# Altium schematic sheet 4_ADC.schdoc.schdoc
size 431 x 309 mm; Symbol: Sheet-Symbol_A4; Device: Sheet-Symbol_A4; Company: 嘉立创EDA; Version: V1.0; Page Size: A4; @Project Name: ProDocument_LN_CTRL_V1; @Page Count: 5; @Update Date: 2026-01-05; @Create Date: 2026-01-05; @Schematic Name: Schematic1; @Page No: 4; @Page Name: ADC
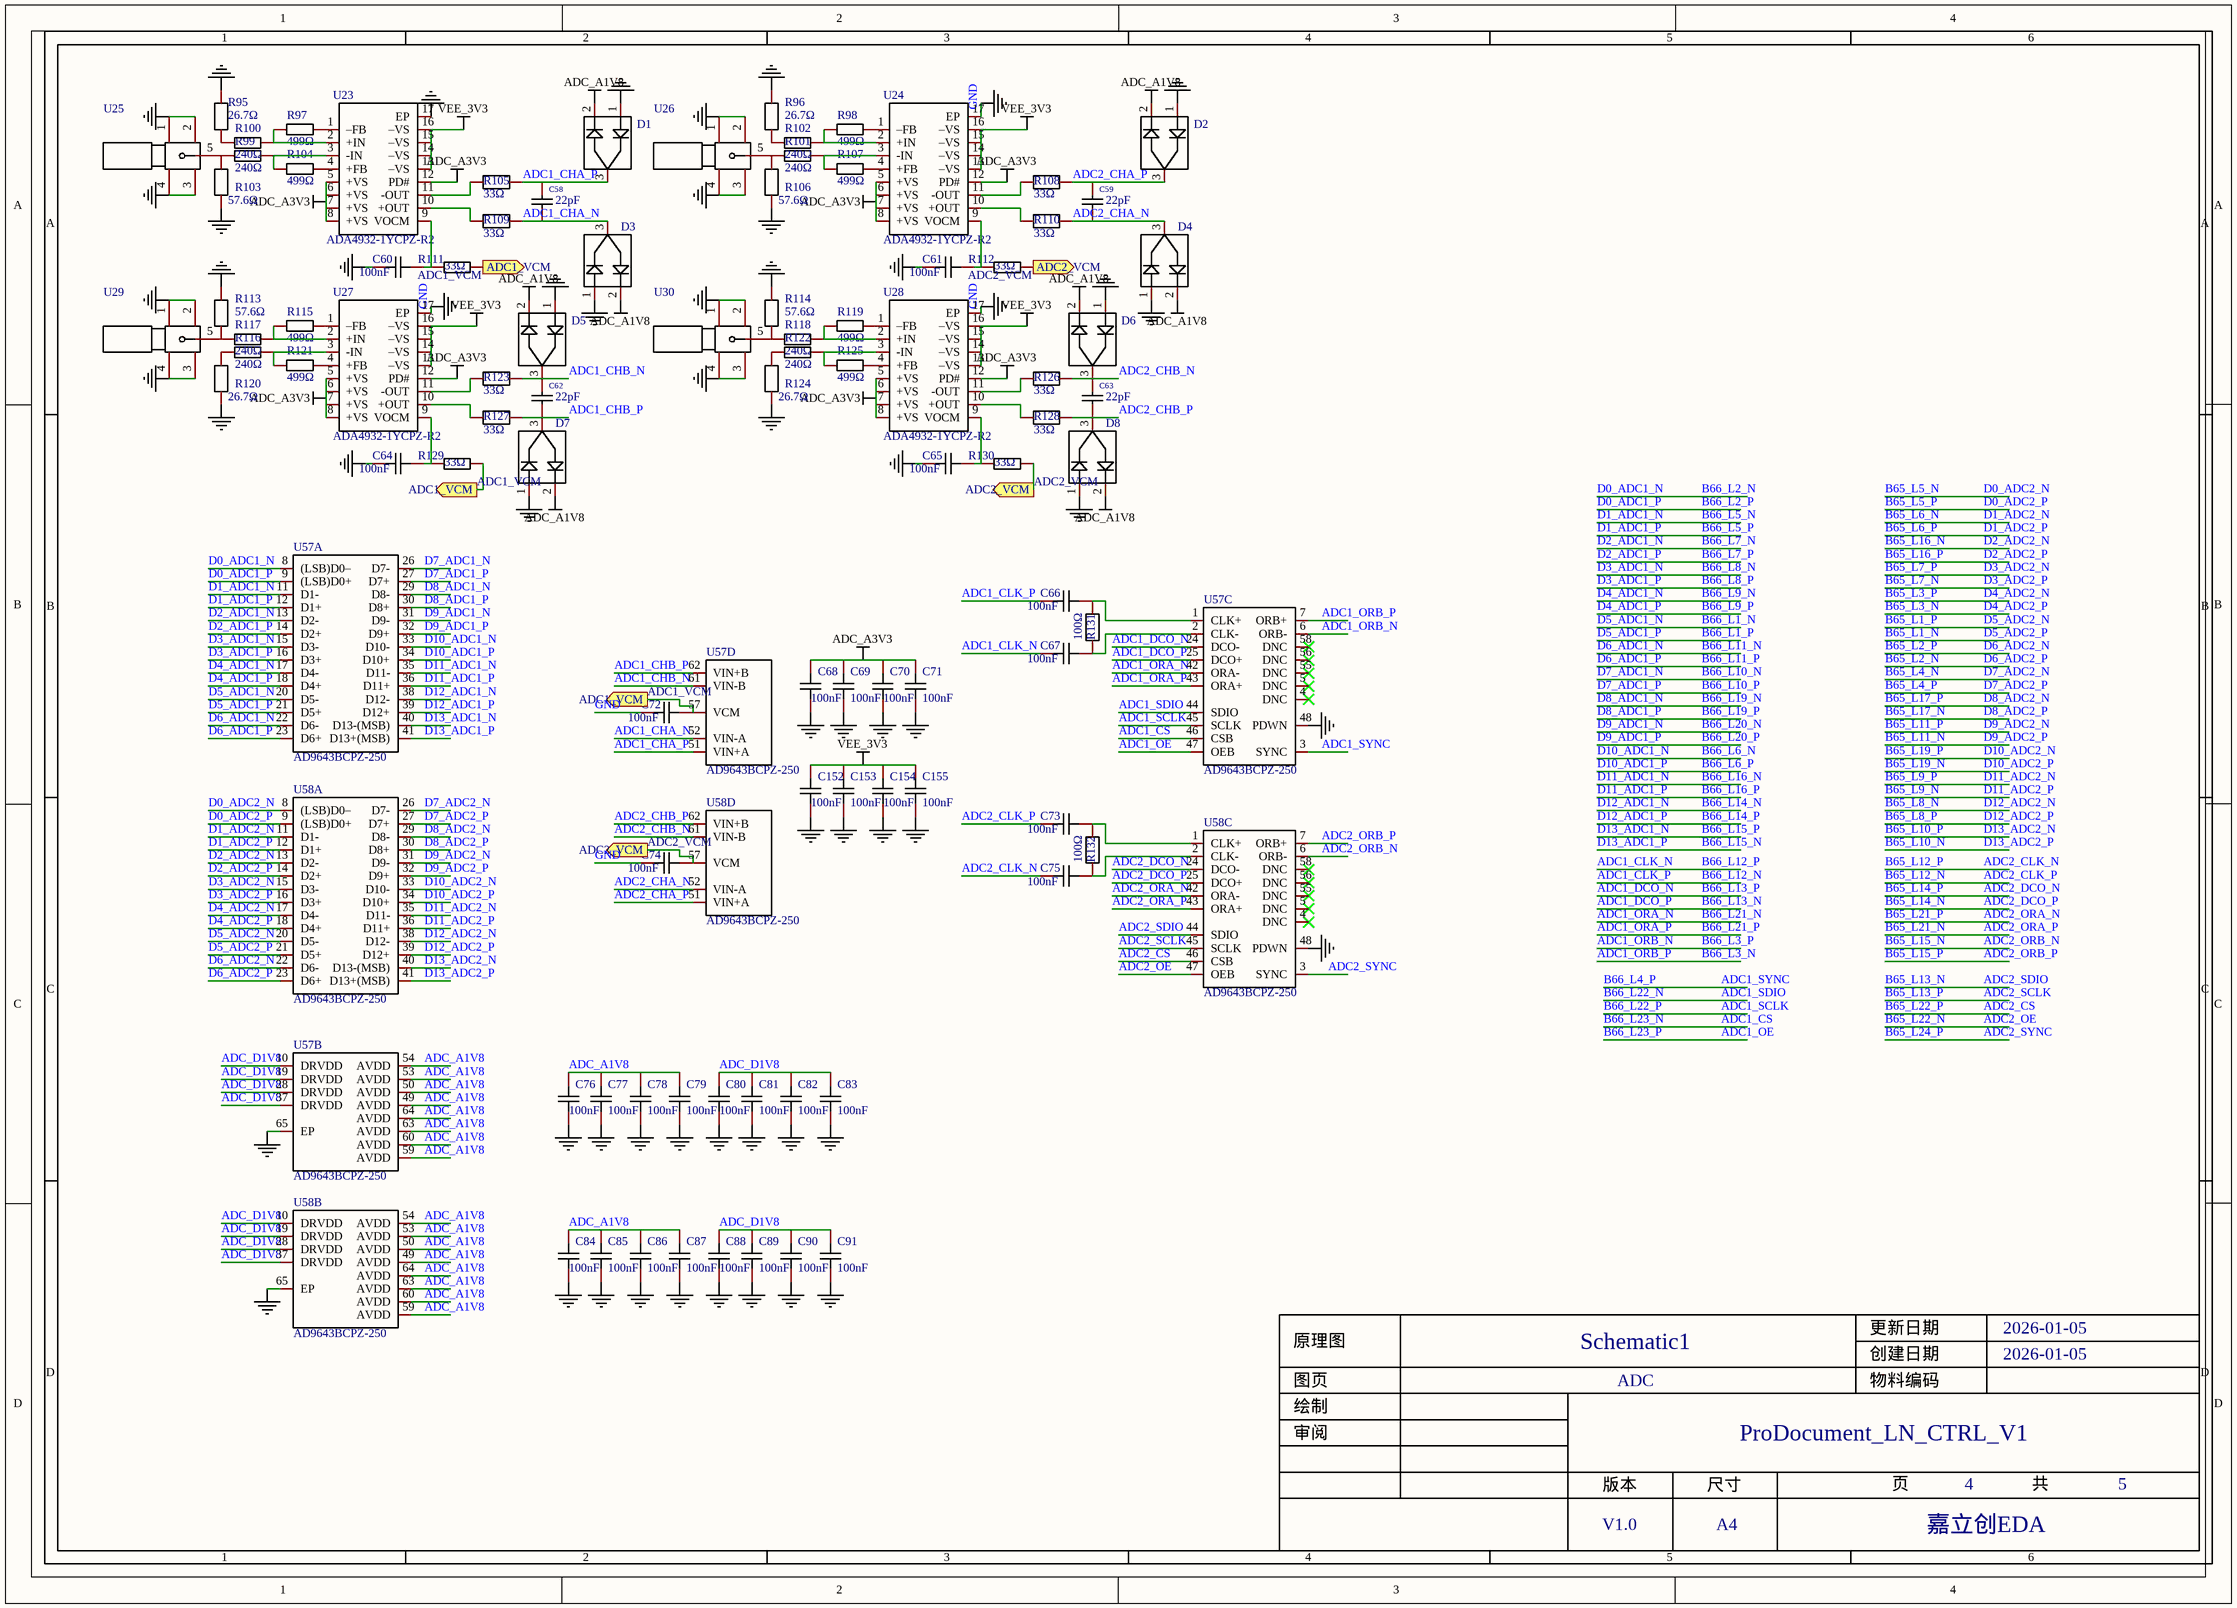
[diagram p0: 4_ADC.schdoc.schdoc]

## Parts
C58  22pF  [C0402]
C59  22pF  [C0402]
C60  100nF  [C0402]
C61  100nF  [C0402]
C62  22pF  [C0402]
C63  22pF  [C0402]
C64  100nF  [C0402]
C65  100nF  [C0402]
C66  100nF  [C0402]
C67  100nF  [C0402]
C68  100nF  [C0402]
C69  100nF  [C0402]
C70  100nF  [C0402]
C71  100nF  [C0402]
C72  100nF  [C0402]
C73  100nF  [C0402]
C74  100nF  [C0402]
C75  100nF  [C0402]
C76  100nF  [C0402]
C77  100nF  [C0402]
C78  100nF  [C0402]
C79  100nF  [C0402]
C80  100nF  [C0402]
C81  100nF  [C0402]
C82  100nF  [C0402]
C83  100nF  [C0402]
C84  100nF  [C0402]
C85  100nF  [C0402]
C86  100nF  [C0402]
C87  100nF  [C0402]
C88  100nF  [C0402]
C89  100nF  [C0402]
C90  100nF  [C0402]
C91  100nF  [C0402]
C152  100nF  [C0402]
C153  100nF  [C0402]
C154  100nF  [C0402]
C155  100nF  [C0402]
D1  NSVR351SDSA3T1G  [SC-59-3_L2.9-W1.5-P0.95-LS2.5-BR]  (value not drawn)
D2  NSVR351SDSA3T1G  [SC-59-3_L2.9-W1.5-P0.95-LS2.5-BR]  (value not drawn)
D3  NSVR351SDSA3T1G  [SC-59-3_L2.9-W1.5-P0.95-LS2.5-BR]  (value not drawn)
D4  NSVR351SDSA3T1G  [SC-59-3_L2.9-W1.5-P0.95-LS2.5-BR]  (value not drawn)
D5  NSVR351SDSA3T1G  [SC-59-3_L2.9-W1.5-P0.95-LS2.5-BR]  (value not drawn)
D6  NSVR351SDSA3T1G  [SC-59-3_L2.9-W1.5-P0.95-LS2.5-BR]  (value not drawn)
D7  NSVR351SDSA3T1G  [SC-59-3_L2.9-W1.5-P0.95-LS2.5-BR]  (value not drawn)
D8  NSVR351SDSA3T1G  [SC-59-3_L2.9-W1.5-P0.95-LS2.5-BR]  (value not drawn)
R95  value 26.7Ω  [R0402]  (hidden comment: ARG02BTC1001)
R96  value 26.7Ω  [R0402]  (hidden comment: ARG02BTC1001)
R97  499Ω  [R0402]
R98  499Ω  [R0402]
R99  240Ω  [R0402]
R100  240Ω  [R0402]
R101  240Ω  [R0402]
R102  240Ω  [R0402]
R103  value 57.6Ω  [R0402]  (hidden comment: ARG02BTC1001)
R104  499Ω  [R0402]
R105  value 33Ω  [R0402]  (hidden comment: ARG02BTC1001)
R106  value 57.6Ω  [R0402]  (hidden comment: ARG02BTC1001)
R107  499Ω  [R0402]
R108  value 33Ω  [R0402]  (hidden comment: ARG02BTC1001)
R109  value 33Ω  [R0402]  (hidden comment: ARG02BTC1001)
R110  value 33Ω  [R0402]  (hidden comment: ARG02BTC1001)
R111  33Ω  [R0402]
R112  33Ω  [R0402]
R113  value 57.6Ω  [R0402]  (hidden comment: ARG02BTC1001)
R114  value 57.6Ω  [R0402]  (hidden comment: ARG02BTC1001)
R115  499Ω  [R0402]
R116  240Ω  [R0402]
R117  240Ω  [R0402]
R118  240Ω  [R0402]
R119  499Ω  [R0402]
R120  value 26.7Ω  [R0402]  (hidden comment: ARG02BTC1001)
R121  499Ω  [R0402]
R122  240Ω  [R0402]
R123  value 33Ω  [R0402]  (hidden comment: ARG02BTC1001)
R124  value 26.7Ω  [R0402]  (hidden comment: ARG02BTC1001)
R125  499Ω  [R0402]
R126  value 33Ω  [R0402]  (hidden comment: ARG02BTC1001)
R127  value 33Ω  [R0402]  (hidden comment: ARG02BTC1001)
R128  value 33Ω  [R0402]  (hidden comment: ARG02BTC1001)
R129  33Ω  [R0402]
R130  33Ω  [R0402]
R131  100Ω  [R0402]
R132  100Ω  [R0402]
U23  ADA4932-1YCPZ-R2  [LFCSP-16_L3.0-W3.0-P0.50-BL-EP1.3]
U24  ADA4932-1YCPZ-R2  [LFCSP-16_L3.0-W3.0-P0.50-BL-EP1.3]
U25  MOLEX_SMA  [MOLEX_SMA]  (value not drawn)
U26  MOLEX_SMA  [MOLEX_SMA]  (value not drawn)
U27  ADA4932-1YCPZ-R2  [LFCSP-16_L3.0-W3.0-P0.50-BL-EP1.3]
U28  ADA4932-1YCPZ-R2  [LFCSP-16_L3.0-W3.0-P0.50-BL-EP1.3]
U29  MOLEX_SMA  [MOLEX_SMA]  (value not drawn)
U30  MOLEX_SMA  [MOLEX_SMA]  (value not drawn)
U57  AD9643BCPZ-250  [LFCSP-64_L9.0-W9.0-P0.50-BL-EP6.2]  (parts A,B,C,D of 4)
U58  AD9643BCPZ-250  [LFCSP-64_L9.0-W9.0-P0.50-BL-EP6.2]  (parts A,B,C,D of 4)

## Ports
ADC1_VCM (out), ADC2_VCM (out)

## Nets
ADC_A1V8: C76.2 C77.2 C78.2 C79.2 C84.2 C85.2 C86.2 C87.2 D1.2(Cathode) D2.2(Cathode) D3.2(Cathode) D4.2(Cathode) D5.2(Cathode) D6.2(Cathode) D7.2(Cathode) D8.2(Cathode) U57.49(AVDD) U57.50(AVDD) U57.53(AVDD) U57.54(AVDD) U57.59(AVDD) U57.60(AVDD) U57.63(AVDD) U57.64(AVDD) U58.49(AVDD) U58.50(AVDD) U58.53(AVDD) U58.54(AVDD) U58.59(AVDD) U58.60(AVDD) U58.63(AVDD) U58.64(AVDD)
ADC_A3V3: C68.2 C69.2 C70.2 C71.2 U23.5(+VS) U23.6(+VS) U23.7(+VS) U23.8(+VS) U23.12(PD#) U24.5(+VS) U24.6(+VS) U24.7(+VS) U24.8(+VS) U24.12(PD#) U27.5(+VS) U27.6(+VS) U27.7(+VS) U27.8(+VS) U27.12(PD#) U28.5(+VS) U28.6(+VS) U28.7(+VS) U28.8(+VS) U28.12(PD#)
GND: C60.2 C61.2 C64.2 C65.2 C68.1 C69.1 C70.1 C71.1 C72.2 C74.2 C76.1 C77.1 C78.1 C79.1 C80.1 C81.1 C82.1 C83.1 C84.1 C85.1 C86.1 C87.1 C88.1 C89.1 C90.1 C91.1 C152.1 C153.1 C154.1 C155.1 D1.1(Anode) D2.1(Anode) D3.1(Anode) D4.1(Anode) D5.1(Anode) D6.1(Anode) D7.1(Anode) D8.1(Anode) R95.1 R96.2 R103.2 R106.1 R113.2 R114.2 R120.1 R124.1 U23.17(EP) U24.17(EP) U25.1 U25.2 U25.3 U25.4 U26.1 U26.2 U26.3 U26.4 U27.17(EP) U28.17(EP) U29.1 U29.2 U29.3 U29.4 U30.1 U30.2 U30.3 U30.4 U57.48(PDWN) U57.65(EP) U58.48(PDWN) U58.65(EP)
VEE_3V3: C152.2 C153.2 C154.2 C155.2 U23.13(–VS) U23.14(–VS) U23.15(–VS) U23.16(–VS) U24.13(–VS) U24.14(–VS) U24.15(–VS) U24.16(–VS) U27.13(–VS) U27.14(–VS) U27.15(–VS) U27.16(–VS) U28.13(–VS) U28.14(–VS) U28.15(–VS) U28.16(–VS)
ADC1_CHA_N: C58.1 D3.3(Anode/Cathode) R109.1 U57.52(VIN-A)
ADC1_CHA_P: C58.2 D1.3(Anode/Cathode) R105.1 U57.51(VIN+A)
ADC1_CHB_N: C62.2 D5.3(Anode/Cathode) R123.1 U57.61(VIN-B)
ADC1_CHB_P: C62.1 D7.3(Anode/Cathode) R127.1 U57.62(VIN+B)
ADC1_CLK_N: C67.2  [also labelled B66_L12_P]
ADC1_CLK_P: C66.2  [also labelled B66_L12_N]
ADC1_CS: U57.46(CSB)  [also labelled B66_L23_N]
ADC1_DCO_N: U57.24(DCO-)  [also labelled B66_L13_P]
ADC1_DCO_P: U57.25(DCO+)  [also labelled B66_L13_N]
ADC1_OE: U57.47(OEB)  [also labelled B66_L23_P]
ADC1_ORA_N: U57.42(ORA-)  [also labelled B66_L21_N]
ADC1_ORA_P: U57.43(ORA+)  [also labelled B66_L21_P]
ADC1_ORB_N: U57.6(ORB-)  [also labelled B66_L3_P]
ADC1_ORB_P: U57.7(ORB+)  [also labelled B66_L3_N]
ADC1_SCLK: U57.45(SCLK)  [also labelled B66_L22_P]
ADC1_SDIO: U57.44(SDIO)  [also labelled B66_L22_N]
ADC1_SYNC: U57.3(SYNC)  [also labelled B66_L4_P]
ADC1_VCM: C72.1 R111.2 R129.2 U57.57(VCM) ; port ADC1_VCM
ADC2_CHA_N: C59.1 D4.3(Anode/Cathode) R110.1 U58.52(VIN-A)
ADC2_CHA_P: C59.2 D2.3(Anode/Cathode) R108.1 U58.51(VIN+A)
ADC2_CHB_N: C63.2 D6.3(Anode/Cathode) R126.1 U58.61(VIN-B)
ADC2_CHB_P: C63.1 D8.3(Anode/Cathode) R128.1 U58.62(VIN+B)
ADC2_CLK_N: C75.2  [also labelled B65_L12_P]
ADC2_CLK_P: C73.2  [also labelled B65_L12_N]
ADC2_CS: U58.46(CSB)  [also labelled B65_L22_P]
ADC2_DCO_N: U58.24(DCO-)  [also labelled B65_L14_P]
ADC2_DCO_P: U58.25(DCO+)  [also labelled B65_L14_N]
ADC2_OE: U58.47(OEB)  [also labelled B65_L22_N]
ADC2_ORA_N: U58.42(ORA-)  [also labelled B65_L21_P]
ADC2_ORA_P: U58.43(ORA+)  [also labelled B65_L21_N]
ADC2_ORB_N: U58.6(ORB-)  [also labelled B65_L15_N]
ADC2_ORB_P: U58.7(ORB+)  [also labelled B65_L15_P]
ADC2_SCLK: U58.45(SCLK)  [also labelled B65_L13_P]
ADC2_SDIO: U58.44(SDIO)  [also labelled B65_L13_N]
ADC2_SYNC: U58.3(SYNC)  [also labelled B65_L24_P]
ADC2_VCM: C74.1 R112.2 R130.2 U58.57(VCM) ; port ADC2_VCM
ADC_D1V8: C80.2 C81.2 C82.2 C83.2 C88.2 C89.2 C90.2 C91.2 U57.10(DRVDD) U57.19(DRVDD) U57.28(DRVDD) U57.37(DRVDD) U58.10(DRVDD) U58.19(DRVDD) U58.28(DRVDD) U58.37(DRVDD)
B65_L1_N: U58.21(D5+)  [also labelled D5_ADC2_P]
B65_L1_P: U58.20(D5-)  [also labelled D5_ADC2_N]
B65_L2_N: U58.23(D6+)  [also labelled D6_ADC2_P]
B65_L2_P: U58.22(D6-)  [also labelled D6_ADC2_N]
B65_L3_N: U58.18(D4+)  [also labelled D4_ADC2_P]
B65_L3_P: U58.17(D4-)  [also labelled D4_ADC2_N]
B65_L4_N: U58.26(D7-)  [also labelled D7_ADC2_N]
B65_L4_P: U58.27(D7+)  [also labelled D7_ADC2_P]
B65_L5_N: U58.8((LSB)D0–)  [also labelled D0_ADC2_N]
B65_L5_P: U58.9((LSB)D0+)  [also labelled D0_ADC2_P]
B65_L6_N: U58.11(D1-)  [also labelled D1_ADC2_N]
B65_L6_P: U58.12(D1+)  [also labelled D1_ADC2_P]
B65_L7_N: U58.16(D3+)  [also labelled D3_ADC2_P]
B65_L7_P: U58.15(D3-)  [also labelled D3_ADC2_N]
B65_L8_N: U58.38(D12-)  [also labelled D12_ADC2_N]
B65_L8_P: U58.39(D12+)  [also labelled D12_ADC2_P]
B65_L9_N: U58.36(D11+)  [also labelled D11_ADC2_P]
B65_L9_P: U58.35(D11-)  [also labelled D11_ADC2_N]
B65_L10_N: U58.41(D13+(MSB))  [also labelled D13_ADC2_P]
B65_L10_P: U58.40(D13-(MSB))  [also labelled D13_ADC2_N]
B65_L11_N: U58.32(D9+)  [also labelled D9_ADC2_P]
B65_L11_P: U58.31(D9-)  [also labelled D9_ADC2_N]
B65_L16_N: U58.13(D2-)  [also labelled D2_ADC2_N]
B65_L16_P: U58.14(D2+)  [also labelled D2_ADC2_P]
B65_L17_N: U58.30(D8+)  [also labelled D8_ADC2_P]
B65_L17_P: U58.29(D8-)  [also labelled D8_ADC2_N]
B65_L19_N: U58.34(D10+)  [also labelled D10_ADC2_P]
B65_L19_P: U58.33(D10-)  [also labelled D10_ADC2_N]
B66_L1_N: U57.20(D5-)  [also labelled D5_ADC1_N]
B66_L1_P: U57.21(D5+)  [also labelled D5_ADC1_P]
B66_L2_N: U57.8((LSB)D0–)  [also labelled D0_ADC1_N]
B66_L2_P: U57.9((LSB)D0+)  [also labelled D0_ADC1_P]
B66_L5_N: U57.11(D1-)  [also labelled D1_ADC1_N]
B66_L5_P: U57.12(D1+)  [also labelled D1_ADC1_P]
B66_L6_N: U57.33(D10-)  [also labelled D10_ADC1_N]
B66_L6_P: U57.34(D10+)  [also labelled D10_ADC1_P]
B66_L7_N: U57.13(D2-)  [also labelled D2_ADC1_N]
B66_L7_P: U57.14(D2+)  [also labelled D2_ADC1_P]
B66_L8_N: U57.15(D3-)  [also labelled D3_ADC1_N]
B66_L8_P: U57.16(D3+)  [also labelled D3_ADC1_P]
B66_L9_N: U57.17(D4-)  [also labelled D4_ADC1_N]
B66_L9_P: U57.18(D4+)  [also labelled D4_ADC1_P]
B66_L10_N: U57.26(D7-)  [also labelled D7_ADC1_N]
B66_L10_P: U57.27(D7+)  [also labelled D7_ADC1_P]
B66_L11_N: U57.22(D6-)  [also labelled D6_ADC1_N]
B66_L11_P: U57.23(D6+)  [also labelled D6_ADC1_P]
B66_L14_N: U57.38(D12-)  [also labelled D12_ADC1_N]
B66_L14_P: U57.39(D12+)  [also labelled D12_ADC1_P]
B66_L15_N: U57.41(D13+(MSB))  [also labelled D13_ADC1_P]
B66_L15_P: U57.40(D13-(MSB))  [also labelled D13_ADC1_N]
B66_L16_N: U57.35(D11-)  [also labelled D11_ADC1_N]
B66_L16_P: U57.36(D11+)  [also labelled D11_ADC1_P]
B66_L19_N: U57.29(D8-)  [also labelled D8_ADC1_N]
B66_L19_P: U57.30(D8+)  [also labelled D8_ADC1_P]
B66_L20_N: U57.31(D9-)  [also labelled D9_ADC1_N]
B66_L20_P: U57.32(D9+)  [also labelled D9_ADC1_P]
NetC60_1: C60.1 R111.1 U23.9(VOCM)
NetC61_1: C61.1 R112.1 U24.9(VOCM)
NetC64_1: C64.1 R129.1 U27.9(VOCM)
NetC65_1: C65.1 R130.1 U28.9(VOCM)
NetC66_1: C66.1 R131.2 U57.1(CLK+)
NetC67_1: C67.1 R131.1 U57.2(CLK-)
NetC73_1: C73.1 R132.2 U58.1(CLK+)
NetC75_1: C75.1 R132.1 U58.2(CLK-)
NetR95_2: R95.2 R100.1
NetR96_1: R96.1 R102.1
NetR97_1: R97.1 R100.2 U23.2(+IN)
NetR97_2: R97.2 U23.1(–FB)
NetR98_1: R98.1 R102.2 U24.2(+IN)
NetR98_2: R98.2 U24.1(–FB)
NetR99_1: R99.1 R103.1 U25.5
NetR99_2: R99.2 R104.1 U23.3(-IN)
NetR101_1: R101.1 R106.2 U26.5
NetR101_2: R101.2 R107.1 U24.3(-IN)
NetR104_2: R104.2 U23.4(+FB)
NetR105_2: R105.2 U23.11(-OUT)
NetR107_2: R107.2 U24.4(+FB)
NetR108_2: R108.2 U24.11(-OUT)
NetR109_2: R109.2 U23.10(+OUT)
NetR110_2: R110.2 U24.10(+OUT)
NetR113_1: R113.1 R117.1 U29.5
NetR114_1: R114.1 R118.1 U30.5
NetR115_1: R115.1 R117.2 U27.2(+IN)
NetR115_2: R115.2 U27.1(–FB)
NetR116_1: R116.1 R120.2
NetR116_2: R116.2 R121.1 U27.3(-IN)
NetR118_2: R118.2 R119.1 U28.2(+IN)
NetR119_2: R119.2 U28.1(–FB)
NetR121_2: R121.2 U27.4(+FB)
NetR122_1: R122.1 R124.2
NetR122_2: R122.2 R125.1 U28.3(-IN)
NetR123_2: R123.2 U27.11(-OUT)
NetR125_2: R125.2 U28.4(+FB)
NetR126_2: R126.2 U28.11(-OUT)
NetR127_2: R127.2 U27.10(+OUT)
NetR128_2: R128.2 U28.10(+OUT)

Not connected (* = marked no-connect by the designer): U57 4(DNC)* 5(DNC)* 55(DNC)* 56(DNC)* 58(DNC)*; U58 4(DNC)* 5(DNC)* 55(DNC)* 56(DNC)* 58(DNC)*

## Notes on the sheet
- 1
- 2
- 3
- 4
- 5
- 6
- A
- B
- C
- D
- 原理图
- Schematic1
- 创建日期
- 更新日期
- 2026-01-05
- 审阅
- 绘制
- 图页
- ADC
- 物料编码
- ProDocument_LN_CTRL_V1
- 版本
- 尺寸
- 页
- 共
- V1.0
- A4
- 嘉立创EDA

## Library data of the parts
C58 C59 C62 C63 = 0402CG220J500NT: Manufacturer: FH(风华); Add into BOM: yes; Tolerance: ±5%; Voltage Rated: 50V; Temperature Coefficient: C0G; Description: 容值:22pF;精度:±5%;额定电压:50V;材质(温度系数):C0G;; Name: 22pF; Symbol: 0402CG220J500NT; Device: 0402CG220J500NT; Supplier: LCSC; Manufacturer Part: 0402CG220J500NT; Capacitance: 22pF; Supplier Part: C1555; JLCPCB Part Class: 基础库; LCSC Part Name: 22pF ±5% 50V; Supplier Footprint: 0402; Datasheet: https://atta.szlcsc.com/upload/public/pdf/source/20200305/C486355_26A10D38EF8C2A5C37091D0039909270.pdf; Convert to PCB: yes; Value: 22pF
C60 C61 C64-C91 C152-C155 = GRM155R71H104KE14D: Manufacturer: muRata(村田); Add into BOM: yes; Tolerance: ±10%; Voltage Rated: 50V; Temperature Coefficient: X7R; Description: 容值:100nF;精度:±10%;额定电压:50V;材质(温度系数):X7R;; Name: 100nF; Symbol: GRM155R71H104KE14D; Device: GRM155R71H104KE14D; LCSC Part Name: 100nF ±10% 50V; Supplier Part: C77020; Manufacturer Part: GRM155R71H104KE14D; Supplier Footprint: 0402; JLCPCB Part Class: 扩展库; Datasheet: https://atta.szlcsc.com/upload/public/pdf/source/20180326/C77020_39BD49C951FF1AF0DB1F1FAC5AC1E401.pdf; Supplier: LCSC; Convert to PCB: yes; Value: 100nF
D1-D8 = NSVR351SDSA3T1G: Manufacturer: onsemi(安森美); Add into BOM: yes; Diode Configuration: 1对串联式; Voltage - Forward(Vf@If): 230mV@1mA; Voltage - DC Reverse(Vr): 5V; Current - Rectified: 30mA; Reverse Leakage Current (Ir): 25uA@0.5V; Description: 二极管配置:1对串联式;正向压降(Vf):230mV@1mA;直流反向耐压(Vr):5V;整流电流:30mA;; Name: NSVR351SDSA3T1G; Symbol: NSVR351SDSA3T1G; Device: NSVR351SDSA3T1G; LCSC Part Name: 电压:5V 电流:30mA; Supplier Part: C604385; Manufacturer Part: NSVR351SDSA3T1G; Supplier Footprint: SC-59; JLCPCB Part Class: 扩展库; Datasheet: https://item.szlcsc.com/datasheet/NSVR351SDSA3T1G/633813.html; Supplier: LCSC; Convert to PCB: yes
R95 R96 R103 R105 R106 R108-R110 R113 R114 R120 R123 R124 R126-R128 = ARG02BTC1001: 阻值:1kΩ;精度:±0.1%;温度系数:±25ppm/;; Manufacturer: Viking(光颉); Add into BOM: yes; Tolerance: ±0.1%; Temperature Coefficient: ±25ppm/; Symbol: ARG02BTC1001; Device: ARG02BTC1001; LCSC Part Name: 1kΩ ±0.1%; Supplier Part: C2984405; Manufacturer Part: ARG02BTC1001; Supplier Footprint: 0402; Datasheet: https://atta.szlcsc.com/upload/public/pdf/source/20200117/C485675_99063924B4564AF910B7BE66DA8EFA49.pdf; Supplier: LCSC; Convert to PCB: yes
R97 R98 R104 R107 R115 R119 R121 R125 = 0402WGF4990TCE: Manufacturer: UNI-ROYAL(厚声); Add into BOM: yes; Tolerance: ±1%; Power(Watts): 62.5mW; Overload Voltage (Max): 50V; Temperature Coefficient: ±100ppm/℃; Description: 电阻类型:厚膜电阻;阻值:499Ω;精度:±1%;功率:62.5mW;最大工作电压:50V;温度系数:±100ppm/℃;; Name: 499Ω; Symbol: 0402WGF4990TCE; Device: 0402WGF4990TCE; LCSC Part Name: 499Ω ±1% 62.5mW 厚膜电阻; Supplier Part: C4125; Manufacturer Part: 0402WGF4990TCE; Supplier Footprint: 0402; JLCPCB Part Class: 扩展库; Datasheet: https://atta.szlcsc.com/upload/public/pdf/source/20200306/C422600_1E6D84923E4A46A82E41ADD87F860B5C.pdf; Supplier: LCSC; Convert to PCB: yes; Type: 厚膜电阻; Value: 499Ω; Operating Temperature Range: -55℃~+155℃
R99-R102 R116-R118 R122 = 0402WGF2400TCE: Manufacturer: UNI-ROYAL(厚声); Add into BOM: yes; Tolerance: ±1%; Power(Watts): 62.5mW; Overload Voltage (Max): 50V; Temperature Coefficient: ±100ppm/℃; Description: 电阻类型:厚膜电阻;阻值:240Ω;精度:±1%;功率:62.5mW;最大工作电压:50V;温度系数:±100ppm/℃;; Name: 240Ω; Symbol: 0402WGF2400TCE; Device: 0402WGF2400TCE; LCSC Part Name: 240Ω ±1% 62.5mW 厚膜电阻; Supplier Part: C25094; Manufacturer Part: 0402WGF2400TCE; Supplier Footprint: 0402; JLCPCB Part Class: 扩展库; Datasheet: https://atta.szlcsc.com/upload/public/pdf/source/20200306/C422600_1E6D84923E4A46A82E41ADD87F860B5C.pdf; Supplier: LCSC; Convert to PCB: yes; Type: 厚膜电阻; Value: 240Ω; Operating Temperature Range: -55℃~+155℃
R111 R112 R129 R130 = 0402WGF330JTCE: Manufacturer: UNI-ROYAL(厚声); Add into BOM: yes; Tolerance: ±1%; Power(Watts): 62.5mW; Voltage-Supply(Max): 50V; Temperature Coefficient: ±100ppm/℃; Description: 电阻类型:厚膜电阻;阻值:33Ω;精度:±1%;功率:62.5mW;工作电压:50V;温度系数:±100ppm/℃;; Name: 33Ω; Symbol: 0402WGF330JTCE; Device: 0402WGF330JTCE; LCSC Part Name: 33Ω ±1% 62.5mW 厚膜电阻; Supplier Part: C25105; Manufacturer Part: 0402WGF330JTCE; Supplier Footprint: 0402; JLCPCB Part Class: 基础库; Datasheet: https://item.szlcsc.com/datasheet/0402WGF330JTCE/25848.html; Supplier: LCSC; Convert to PCB: yes; Type: 厚膜电阻; Value: 33Ω; Operating Temperature: -55℃~+155℃
R131 R132 = RT0402BRD07100RL: Manufacturer: YAGEO(国巨); Add into BOM: yes; Tolerance: ±0.1%; Power(Watts): 62.5mW; Voltage-Supply(Max): 50V; Temperature Coefficient: ±25ppm/℃; Description: 电阻类型:薄膜电阻;阻值:100Ω;精度:±0.1%;功率:62.5mW;工作电压:50V;温度系数:±25ppm/℃;; Name: 100Ω; Symbol: RT0402BRD07100RL; Device: RT0402BRD07100RL; LCSC Part Name: 薄膜电阻 100Ω ±0.1% 62.5mW; Supplier Part: C705627; Manufacturer Part: RT0402BRD07100RL; Supplier Footprint: 0402; JLCPCB Part Class: 扩展库; Datasheet: https://atta.szlcsc.com/upload/public/pdf/source/20250609/0E6D5617EADA80FA3B707391883DF2D5.pdf; Supplier: LCSC; Convert to PCB: yes; Type: 薄膜电阻; Value: 100Ω; Operating Temperature: -55℃~+155℃
U23 U24 U27 U28 = ADA4932-1YCPZ-R2: Manufacturer: ADI(亚德诺); Add into BOM: yes; Number of Circuits: 单路; Common Mode Rejection Ratio (CMRR): 100dB; Current - Input Bias(Ib): 2.5uA; Voltage - Input Offset(Vos): 500uV; Slew Rate(SR): 2800V/us; Supply Voltage: 3V~5V; -3db Bandwidth: 560MHz; Input Offset Voltage Drift (Vos TC): 3.7uV/℃; Supply Current: 9.6mA; Description: 放大器数:单路;共模抑制比(CMRR):100dB;输入偏置电流(Ib):2.5uA;输入失调电压(Vos):500uV;增益带宽积(GBP):-;压摆率(SR):2800V/us;带宽(-3db):560MHz;; Name: ADA4932-1YCPZ-R2; Symbol: ADA4932-1YCPZ-R2; Device: ADA4932-1YCPZ-R2; LCSC Part Name: 高性能低功耗差分ADC驱动器; Supplier Part: C494505; Manufacturer Part: ADA4932-1YCPZ-R2; Supplier Footprint: LFCSP-16(3x3); JLCPCB Part Class: 扩展库; Datasheet: https://atta.szlcsc.com/upload/public/pdf/source/20200309/C494505_BB399B04ACF7E8080BF0845658E50F75.pdf; Supplier: LCSC; Convert to PCB: yes; Gain Bandwidth Product(GBP): -; Operating Temperature: -40℃~+105℃
U25 U26 U29 U30 = MOLEX_SMA: Add into BOM: yes; Description: C296128; Symbol: MOLEX_SMA; Device: MOLEX_SMA; Convert to PCB: yes
U57 U58 = AD9643BCPZ-250: Manufacturer: ADI(亚德诺); Add into BOM: yes; Interface: 并行; differential input: 是; number of channels: 2; Supply Voltage: 1.7V~1.9V; sampling frequency: 250MHz; resolution: 14; Description: 接口:并行;电源电压:1.7V~1.9V;采样率:250MHz;分辨率:14;; Name: AD9643BCPZ-250; Symbol: AD9643BCPZ-250; Device: AD9643BCPZ-250; LCSC Part Name: 14位，170 MSPS/210 MSPS/250 MSPS，1.8 V 双通道模数转换器（ADC）; Supplier Part: C653687; Manufacturer Part: AD9643BCPZ-250; Supplier Footprint: LFCSP-64(9x9); JLCPCB Part Class: 扩展库; Datasheet: https://atta.szlcsc.com/upload/public/pdf/source/20210202/C653686_A37F23B3A48DA588C28A43E276C751ED.pdf; Supplier: LCSC; Convert to PCB: yes; Operating Temperature: -40℃~+85℃